# Altium project VoxPopuli.PrjPCB
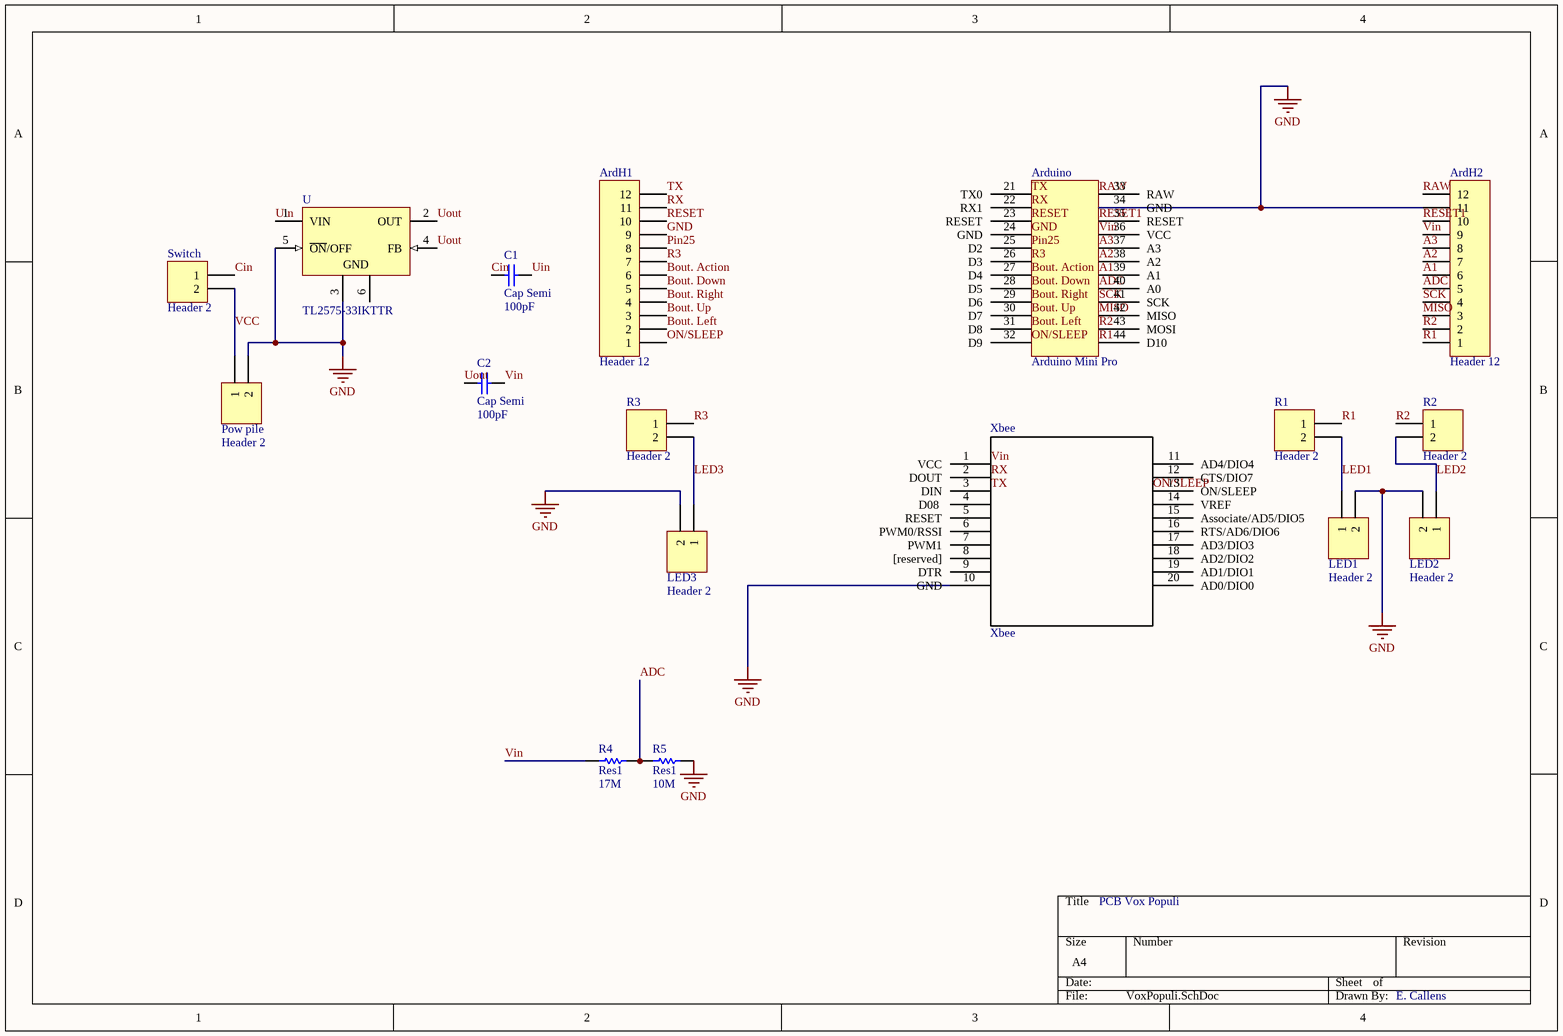
[diagram p0: VoxPopuli.SchDoc]
1 sheet, 17 parts. Net scope: global (net labels, ports and power ports of the same name join across sheets).
Board file: VoxPopuli.PcbDoc

## Sheet VoxPopuli.SchDoc
size A4

### Parts
ArdH1  Header 12  [HEADER 12]
ArdH2  Header 12  [HEADER 12]
Arduino  Arduino Mini Pro  [ARDUINO DIP 2]
C1  Cap Semi  value 100pF  [C1206]
C2  Cap Semi  value 100pF  [C1206]
LED1  Header 2  [HEADER 2]
LED2  Header 2  [HEADER 2]
LED3  Header 2  [HEADER 2]
Pow_pile  Header 2  [HEADER 2]
R1  Header 2  [HEADER 2]
R2  Header 2  [HEADER 2]
R3  Header 2  [HEADER 2]
R4  Res1  value 17M  [C1206]
R5  Res1  value 10M  [C1206]
Switch  Header 2  [HEADER 2]
U  TL2575-33IKTTR  [KTT5_N]
Xbee  Xbee  [XBEE DIP 2]

### Nets
GND: ArdH1.9 ArdH2.11 Arduino.24(GND) Arduino.34(GND) LED1.2 LED2.2 LED3.2 Pow_pile.2 R5.2 U.3(GND) U.5(~{ON}/OFF) Xbee.10(GND)
A1: ArdH2.6 Arduino.39(A1)
A2: ArdH2.7 Arduino.38(A2)
A3: ArdH2.8 Arduino.37(A3)
ADC: ArdH2.5 Arduino.40(A0) R4.2 R5.1
Bout. Action: ArdH1.6 Arduino.27(D4)
Bout. Down: ArdH1.5 Arduino.28(D5)
Bout. Left: ArdH1.2 Arduino.31(D8)
Bout. Right: ArdH1.4 Arduino.29(D6)
Bout. Up: ArdH1.3 Arduino.30(D7)
Cin: C1.1 Switch.1
LED1: LED1.1 R1.2
LED2: LED2.1 R2.2
LED3: LED3.1 R3.2
MISO: ArdH2.3 Arduino.42(MISO)
ON/SLEEP: ArdH1.1 Arduino.32(D9) Xbee.13(ON/SLEEP)
Pin25: ArdH1.8 Arduino.25(D2)
R1: ArdH2.1 Arduino.44(D10) R1.1
R2: ArdH2.2 Arduino.43(MOSI) R2.1
R3: ArdH1.7 Arduino.26(D3) R3.1
RAW: ArdH2.12 Arduino.33(RAW)
RESET: ArdH1.10 Arduino.23(RESET)
RESET1: ArdH2.10 Arduino.35(RESET)
RX: ArdH1.11 Arduino.22(RX1) Xbee.2(DOUT)
SCK: ArdH2.4 Arduino.41(SCK)
TX: ArdH1.12 Arduino.21(TX0) Xbee.3(DIN)
Uin: C1.2 U.1(VIN)
Uout: C2.1 U.2(OUT) U.4(FB)
VCC: Pow_pile.1 Switch.2
Vin: ArdH2.9 Arduino.36(VCC) C2.2 R4.1 Xbee.1(VCC)

Not connected (* = marked no-connect by the designer): U 6(GND); Xbee 4(D08) 5(RESET) 6(PWM0/RSSI) 7(PWM1) 8([reserved]) 9(DTR) 11(AD4/DIO4) 12(CTS/DIO7) 14(VREF) 15(Associate/AD5/DIO5) 16(RTS/AD6/DIO6) 17(AD3/DIO3) 18(AD2/DIO2) 19(AD1/DIO1) 20(AD0/DIO0)

### Notes on the sheet
- PCB Vox Populi
- E. Callens

### Library data of the parts
ArdH1 ArdH2 = Header 12: Header, 12-Pin; LatestRevisionDate: 17-Jul-2002; LatestRevisionNote: Re-released for DXP Platform.; Publisher: Altium Limited
Arduino = Arduino Mini Pro: Arduino Board
C1 C2 = Cap Semi: Capacitor (Semiconductor SIM Model); Published: 8-Jun-2000; LatestRevisionDate: 29-May-2009; LatestRevisionNote: IPC-7351 Footprint Added.; PackageReference: C1206; Publisher: Altium Limited; PackageDescription: Chip Capacitor
LED1-LED3 Pow_pile R1-R3 Switch = Header 2: Header, 2-Pin; LatestRevisionDate: 17-Jul-2002; LatestRevisionNote: Re-released for DXP Platform.; Publisher: Altium Limited
R4 R5 = Res1: Resistor; Published: 8-Jun-2000; LatestRevisionDate: 17-Jul-2002; LatestRevisionNote: Re-released for DXP Platform.; PackageReference: AXIAL-0.3; Publisher: Altium Limited; PackageDescription: Axial Device, Thru-Hole; 2 Leads; 0.3 in Pin Spacing
U = TL2575-33IKTTR: Buck Step Down Regulator with 4.75 to 40 V Input and 3.3 V Output, -40 to 125 degC, 5-Pin DDPAK/TO-263 (KTT), Green (RoHS & no Sb/Br); Manufacturer: Texas Instruments; Duty Cycle(Max)(%): 98; Iout(Max)(A): 1; Iq(Typ)(mA): 5; Preset Vout(V): 3.3; Rating: Catalog; SubFamily: Step-Down Regulator; Switch Current Limit(Typ)(A): 2.8; Vin(Max)(V): 40; Vin(Min)(V): 4.75; DatasheetVersion: SLVS638B; PackageVersion: revF, Jul-2011; PackageReference: KTT5; PackageDescription: 6-Pin Plastic Fange-Mount Package 1.7 mm Pitch, 15.2 mm Lead Span; Supplier 1: Digi-Key; Supplier Part Number 1: 296-21828-2-ND; Supplier 2: Digi-Key; Supplier Part Number 2: 296-21828-1-ND; Supplier 3: Digi-Key; Supplier Part Number 3: 296-21828-6-ND; Supplier 4: Farnell; Supplier Part Number 4: 1755280; Supplier 5: Newark; Supplier Part Number 5: 27M1032; Supplier 6: Mouser; Supplier Part Number 6: 595-TL2575-33IKTTR; Eco-Plan: Green (RoHS & no Sb/Br); Regulated Outputs(#): 1; Topology: Buck; Vout(Max)(V): 3.3; Vout(Min)(V): 3.3; Mounting Technology: Surface Mount; Code_JEDEC: TO-263-AB; PartNumber: TL2575-33IKTTR; ComponentLink1Description: Datasheet; ComponentLink1URL: http://www.ti.com/general/docs/lit/getliterature.tsp?genericPartNumber=TL2575-33&fileType=pdf; ComponentLink2Description: Package Specification; ComponentLink2URL: http://www.ti.com/litv/pdf/mpsf007e; ComponentLink3Description: URL Link1; ComponentLink3URL: Samples URL:http://www.ti.com/product/tl2575-33#samples
Xbee = Xbee: Xbee Card